# Altium schematic sheet supply.SchDoc
size A4
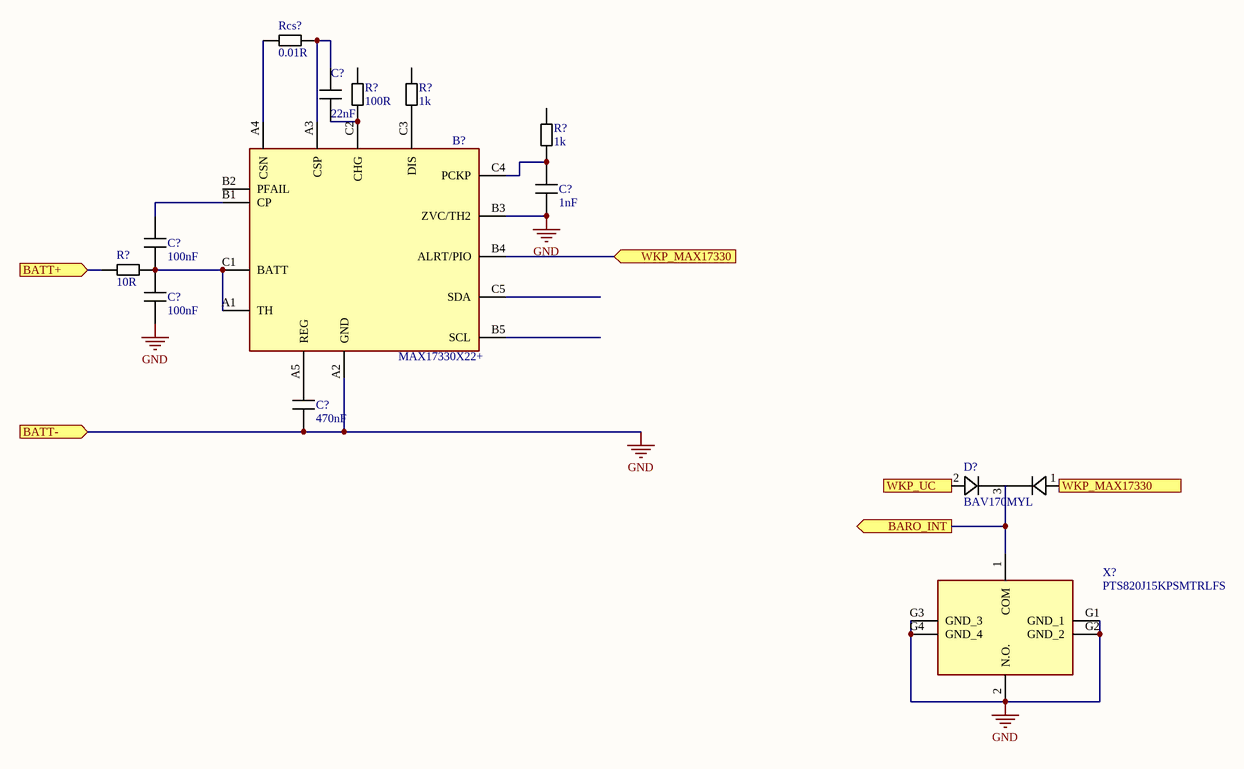
[diagram p0: supply.SchDoc]

## Parts
(Parts that share a designator on the sheet are numbered #1, #2 ... from top to bottom, then left to right.)
B?  MAX17330X22+  [BGA15C50P5X3_245X191X69]
C?#1  value 22nF  [C0402]  (hidden comment: 22nF (0402))
C?#2  value 1nF  [C0402]  (hidden comment: 1nF (0402) AEC-Q200)
C?#3  value 100nF  [C0402]  (hidden comment: 100nF (0402) AEC-Q200)
C?#4  value 100nF  [C0402]  (hidden comment: 100nF (0402) AEC-Q200)
C?#5  value 470nF  [C0402]  (hidden comment: 470nF (0402) AEC-Q200)
D?  BAV170MYL  [DFN1006-3]
R?#1  value 100R  [R0402]  (hidden comment: 100R (0402))
R?#2  value 1k  [R0402]  (hidden comment: 1k (0402) AEC-Q200)
R?#3  value 1k  [R0402]  (hidden comment: 1k (0402) AEC-Q200)
R?#4  value 10R  [R0402]  (hidden comment: 10R (0402))
Rcs?  value 0.01R  [R0402]  (hidden comment: 0.01R (0402) Current Sense)
X?  PTS820J15KPSMTRLFS  [PTS820J15KPSMTRLFS]

## Ports
BARO_INT (out), BATT+ (in), BATT- (in), WKP_MAX17330 (in), WKP_MAX17330 (out), WKP_UC (out)

## Nets
GND: B?.A2(GND) B?.B3(ZVC/TH2) C?#2.2 C?#4.2 C?#5.2 X?.2(N.O.) X?.G1(GND_1) X?.G2(GND_2) X?.G3(GND_3) X?.G4(GND_4) ; port BATT-
BARO_INT: D?.3(C1/A2) X?.1(COM) ; port BARO_INT
BATT+: R?#4.1 ; port BATT+
WKP_MAX17330: B?.B4(ALRT/PIO) D?.1(A1) ; port WKP_MAX17330
WKP_UC: D?.2(K2) ; port WKP_UC
NetB?_A1: B?.A1(TH) B?.C1(BATT) C?#3.2 C?#4.1 R?#4.2
NetB?_A3: B?.A3(CSP) C?#1.1 Rcs?.1
NetB?_A4: B?.A4(CSN) Rcs?.2
NetB?_A5: B?.A5(REG) C?#5.1
NetB?_B1: B?.B1(CP) C?#3.1
NetB?_C2: B?.C2(CHG) C?#1.2 R?#1.2
NetB?_C3: B?.C3(DIS) R?#2.2
NetB?_C4: B?.C4(PCKP) C?#2.1 R?#3.2

Not connected (* = marked no-connect by the designer): B? B2(PFAIL) B5(SCL) C5(SDA); R?#1 1; R?#2 1; R?#3 1

## Library data of the parts
B? = MAX17330X22+: Battery Management 1 Cell Fuel Gauge with ModelGauge m5 EZ, Charger, Protector and SHA-256 Authentication; Manufacturer_Name: Analog Devices; Geometry.Height: 0.69mm; Mouser Part Number: 700-MAX17330X22+; Mouser Price/Stock: https://www.mouser.co.uk/ProductDetail/Maxim-Integrated/MAX17330X22%2b?qs=Jslch3jnSjlOoJCBX3FFdw%3D%3D; Manufacturer_Part_Number: MAX17330X22+; Datasheet Link: https://datasheets.maximintegrated.com/en/ds/MAX17330.pdf
C?#1 = 22nF (0402): X7R 0402 10% 50V; Fabricant: MURATA; Référence: GRM155R71H223KA12D
C?#2 = 1nF (0402) AEC-Q200: X7R 0402 10% 50V AEC-Q200; Fabricant: MURATA; Référence: GCM155R71H102KA37J
C?#3 C?#4 = 100nF (0402) AEC-Q200: X7R 0402 10% 50V AEC-Q200; Référence: GCM155R71H104KE02J; Fabricant: MURATA
C?#5 = 470nF (0402) AEC-Q200: X7R 0402 10% 10V AEC-Q200; Fabricant: MURATA; Référence: GRT155R71A474KE01D
D? = BAV170MYL: Diodes - General Purpose, Power, Switching BAV170M/SOT883/XQFN3; Fabricant: Nexperia; Référence: BAV170MYL; Value: BAV170MYL
R?#1 = 100R (0402): 1% 0402 0.063W 100ppm; Fabricant: MULTICOMP; Référence: MCWR04X1000FTL
R?#2 R?#3 = 1k (0402) AEC-Q200: 1% 0402 0.1W 100ppm AEC-Q200; Fabricant: Panasonic; Référence: ERJ-2RKF1001X
R?#4 = 10R (0402): 1% 0402 0.063W 50V; Référence: CRG0402F10R; Fabricant: TE CONNECTIVITY
Rcs? = 0.01R (0402) Current Sense: 1% 0402 0.33W 50V; Référence: LVT04R0100FER; Fabricant: Ohmite
X? = PTS820J15KPSMTRLFS: Tactile Switches Microminiature SMT Top Actuated; Manufacturer_Name: C & K COMPONENTS; Geometry.Height: 1.5mm; Mouser Part Number: 611-PTS820J15KPSMTR; Mouser Price/Stock: https://www.mouser.co.uk/ProductDetail/CK/PTS820J15KPSMTRLFS?qs=d72FGnIDsgRkhUoD4W29wQ%3D%3D; Manufacturer_Part_Number: PTS820J15KPSMTRLFS; Datasheet Link: https://www.ckswitches.com/media/1474/pts820.pdf